# Altium schematic sheet 19V_Converter3_12_2018.SchDoc
size A
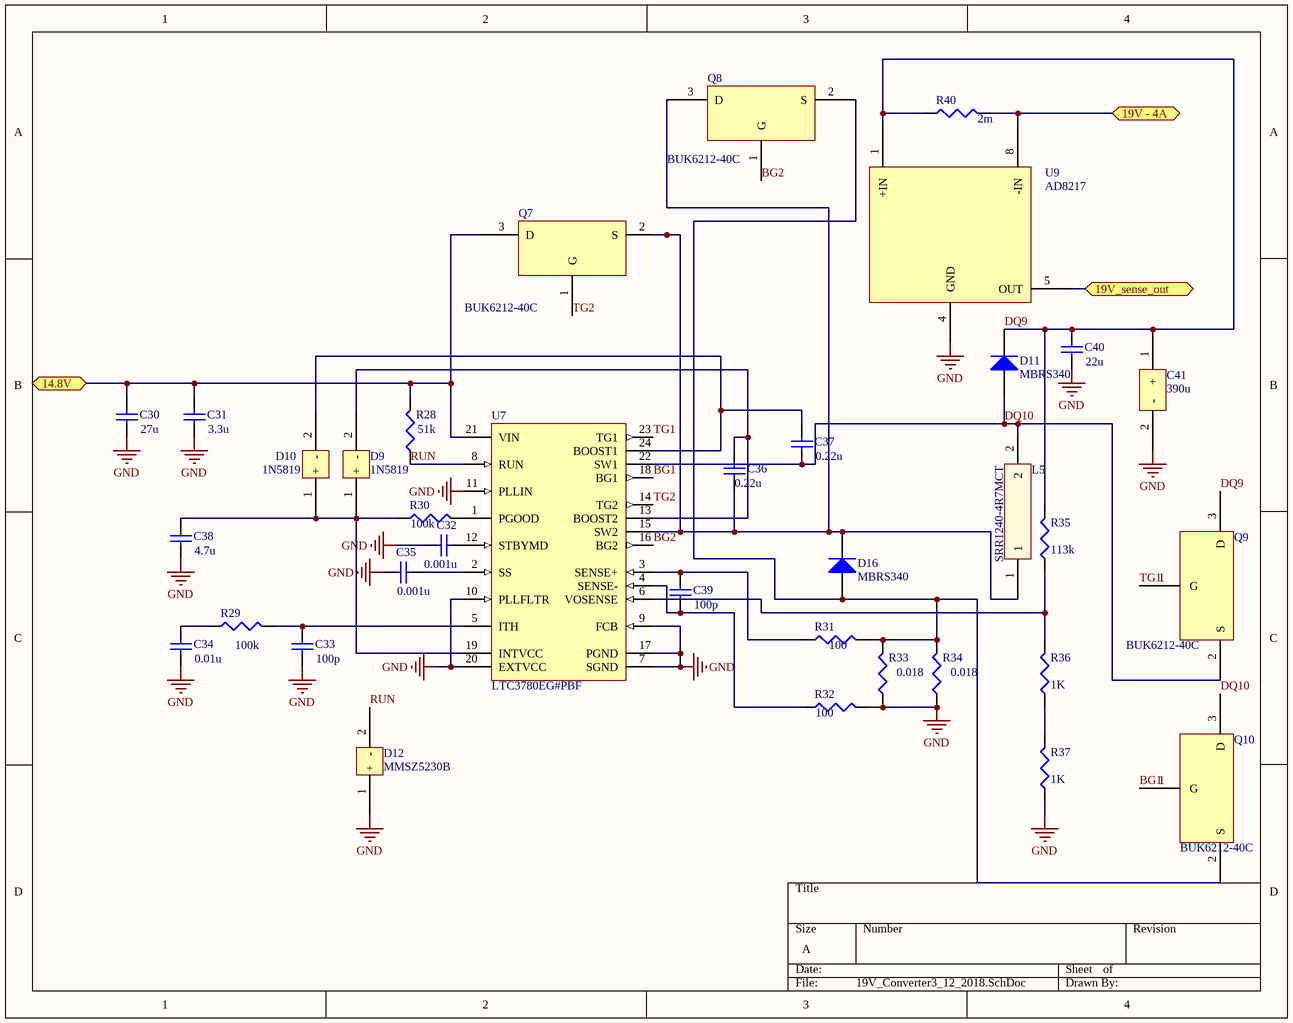
[diagram p0: 19V_Converter3_12_2018.SchDoc]

## Parts
C30  value 27u  [C1206]  (hidden comment: Cap Semi)
C31  value 3.3u  [C1206]  (hidden comment: Cap Semi)
C32  value 0.001u  [C1206]  (hidden comment: Cap Semi)
C33  value 100p  [C1206]  (hidden comment: Cap Semi)
C34  value 0.01u  [C1206]  (hidden comment: Cap Semi)
C35  value 0.001u  [C1206]  (hidden comment: Cap Semi)
C36  value 0.22u  [C1206]  (hidden comment: Cap Semi)
C37  value 0.22u  [C1206]  (hidden comment: Cap Semi)
C38  value 4.7u  [C1206]  (hidden comment: Cap Semi)
C39  value 100p  [C1206]  (hidden comment: Cap Semi)
C40  value 22u  [C1206]  (hidden comment: Cap Semi)
C41  390u  [CAPR5-4X5]
D9  1N5819  [SODFL370X175-2N]
D10  1N5819  [SODFL370X175-2N]
D11  MBRS340  [SMC]
D12  MMSZ5230B  [SODFL370X175-2N]
D16  MBRS340  [SMC]
L5  SRR1240-4R7MCT  [INDP125125X40N]
Q7  BUK6212-40C  [DPAK228P1000X238-3N]
Q8  BUK6212-40C  [DPAK228P1000X238-3N]
Q9  BUK6212-40C  [DPAK228P1000X238-3N]
Q10  BUK6212-40C  [DPAK228P1000X238-3N]
R28  value 51k  [J1-0603]  (hidden comment: Res3)
R29  value 100k  [J1-0603]  (hidden comment: Res3)
R30  value 100k  [J1-0603]  (hidden comment: Res3)
R31  value 100  [J1-0603]  (hidden comment: Res3)
R32  value 100  [J1-0603]  (hidden comment: Res3)
R33  value 0.018  [J1-0603]  (hidden comment: Res3)
R34  value 0.018  [J1-0603]  (hidden comment: Res3)
R35  value 113k  [J1-0603]  (hidden comment: Res3)
R36  value 1K  [J1-0603]  (hidden comment: Res3)
R37  value 1K  [J1-0603]  (hidden comment: Res3)
R40  value 2m  [14-1210]  (hidden comment: Res3)
U7  LTC3780EG#PBF  [SOP65P780X200-24N]
U9  AD8217  [TSOP65P490X110-8N]

## Ports
14.8V, 19V - 4A, 19V_sense_out

## Nets
GND: C30.1 C31.1 C32.1 C33.1 C34.1 C35.1 C38.1 C40.1 C41.2(-) D12.1(+) R32.2 R33.1 R34.1 R37.1 U7.7(SGND) U7.9(FCB) U7.10(PLLFLTR) U7.11(PLLIN) U7.17(PGND) U7.20(EXTVCC) U9.4(GND)
14.8V: C30.2 C31.2 Q7.3(D) R28.2 U7.21(VIN) ; port 14.8V
19V - 4A: R40.2 U9.8(-IN) ; port 19V - 4A
19V_sense_out: U9.5(OUT) ; port 19V_sense_out
BG1: Q10.1(G) U7.18(BG1)
BG2: Q8.1(G) U7.16(BG2)
DQ9: C40.2 C41.1(+) D11.2(K) Q9.3(D) R35.2 R40.1 U9.1(+IN)
DQ10: C37.1 D11.1(A) L5.2 Q9.2(S) Q10.3(D) U7.22(SW1)
RUN: D12.2(-) R28.1 U7.8(RUN)
TG1: Q9.1(G) U7.23(TG1)
TG2: Q7.1(G) U7.14(TG2)
NetC32_2: C32.2 U7.12(STBYMD)
NetC33_2: C33.2 R29.2 U7.5(ITH)
NetC34_2: C34.2 R29.1
NetC35_2: C35.2 U7.2(SS)
NetC36_1: C36.1 D16.2(K) L5.1 Q7.2(S) Q8.3(D) U7.15(SW2)
NetC36_2: C36.2 D9.2(-) U7.13(BOOST2)
NetC37_2: C37.2 D10.2(-) U7.24(BOOST1)
NetC38_2: C38.2 D9.1(+) D10.1(+) R30.1 U7.19(INTVCC)
NetC39_1: C39.1 R32.1 U7.4(SENSE-)
NetC39_2: C39.2 R31.1 U7.3(SENSE+)
NetD16_1: D16.1(A) Q8.2(S) Q10.2(S) R31.2 R33.2 R34.2
NetR30_2: R30.2 U7.1(PGOOD)
NetR35_1: R35.1 R36.2 U7.6(VOSENSE)
NetR36_1: R36.1 R37.2

## Library data of the parts
C30-C40 = Cap Semi: Capacitor (Semiconductor SIM Model); Published: 8-Jun-2000; LatestRevisionDate: 29-May-2009; LatestRevisionNote: IPC-7351 Footprint Added.; PackageReference: C1206; Publisher: Altium Limited; PackageDescription: Chip Capacitor
C41 = Alum_Cap
D9 D10 D12 Q7-Q10 = Component_1
D11 D16 = Diode: Default Diode; Published: 8-Jun-2000; LatestRevisionDate: 17-Jul-2002; LatestRevisionNote: Re-released for DXP Platform.; PackageVersion: Sep-1996; PackageReference: SMC; Publisher: Altium Limited; PackageDescription: DO-214-AB/SMC; 2 C-Bend Leads; Body 7.9 x 5.9 mm, inc. leads (LxW); Code_JEDEC: DO-214-AB
R28-R37 R40 = Res3: Resistor; Published: 8-Jun-2000; LatestRevisionDate: 29-May-2009; LatestRevisionNote: IPC-7351 Footprint Added.; PackageReference: J1-0603; Publisher: Altium Limited; PackageDescription: Chip Resistor
U7 = LTC3780EG#PBF: Buck-boost Controller, Constant Frequency, Current Mode Control with Power Good Output, 24-pin SOP (G-24), -40 to 85 degC, Pb-Free; Manufacturer: Linear Technology; Frequency Sync Range: 200kHz - 400kHz; Number of Outputs: 1; DatasheetVersion: Rev. F; PackageVersion: Jun-10; PackageReference: G-24; PackageDescription: 24-Pin Plastic SSOP, Body 8.2 x 5.3 mm, Pitch 0.65 mm; Supplier 1: Digi-Key; Supplier Part Number 1: LTC3780EG#PBF-ND; Supplier 2: Farnell; Supplier Part Number 2: 1273545; Supplier 3: Newark; Supplier Part Number 3: 56M8395; RoHS: TRUE; Mounting Technology: Surface Mount; PartNumber: LTC3780EG#PBF; ComponentLink1Description: Manufacturer URL; ComponentLink1URL: http://www.linear.com/; ComponentLink2Description: Datasheet; ComponentLink2URL: http://cds.linear.com/docs/en/datasheet/3780ff.pdf; ComponentLink3Description: Package Specification; ComponentLink3URL: http://cds.linear.com/docs/en/packaging/SSOP_24_05-08-1640.pdf
U9 = Component_1: Current Shunt Moniter